# Altium project pay-optical-tls2591.PrjPCB
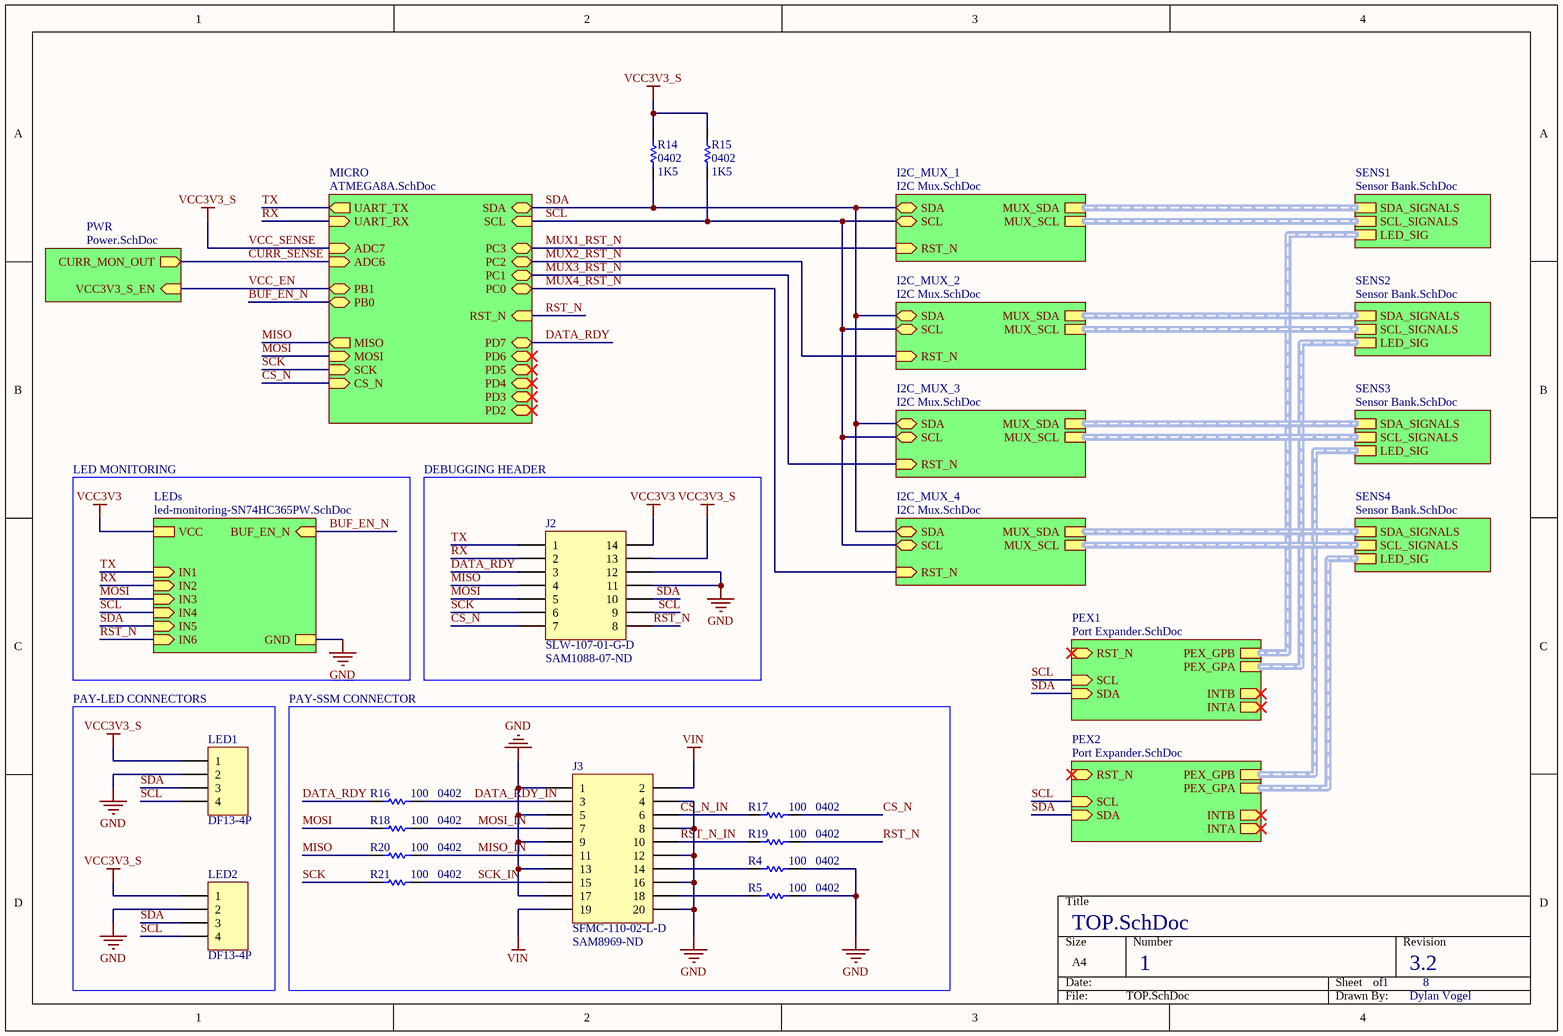
[diagram p0: TOP.SchDoc]
PROJ_AUTHOR: Dylan Vogel; PROJ_ORG: UTAT SS; PROJ_VERSION: 3.2
4 sheets, 251 parts. Net scope: hierarchical (ports join the sheet entries above them; power ports are global).
Board file: pay-optical-tls2591.PcbDoc
Sheets:
  TOP.SchDoc
    MICRO = ATMEGA8A.SchDoc
    SENS1 = Sensor Bank.SchDoc
      TSL2591_1 = TSL2591.SchDoc
      TSL2591_2 = TSL2591.SchDoc
      TSL2591_3 = TSL2591.SchDoc
      TSL2591_4 = TSL2591.SchDoc
      TSL2591_5 = TSL2591.SchDoc
      TSL2591_6 = TSL2591.SchDoc
      TSL2591_7 = TSL2591.SchDoc
      TSL2591_8 = TSL2591.SchDoc
    SENS2 = Sensor Bank.SchDoc
      TSL2591_1 = TSL2591.SchDoc
      TSL2591_2 = TSL2591.SchDoc
      TSL2591_3 = TSL2591.SchDoc
      TSL2591_4 = TSL2591.SchDoc
      TSL2591_5 = TSL2591.SchDoc
      TSL2591_6 = TSL2591.SchDoc
      TSL2591_7 = TSL2591.SchDoc
      TSL2591_8 = TSL2591.SchDoc
    SENS3 = Sensor Bank.SchDoc
      TSL2591_1 = TSL2591.SchDoc
      TSL2591_2 = TSL2591.SchDoc
      TSL2591_3 = TSL2591.SchDoc
      TSL2591_4 = TSL2591.SchDoc
      TSL2591_5 = TSL2591.SchDoc
      TSL2591_6 = TSL2591.SchDoc
      TSL2591_7 = TSL2591.SchDoc
      TSL2591_8 = TSL2591.SchDoc
    SENS4 = Sensor Bank.SchDoc
      TSL2591_1 = TSL2591.SchDoc
      TSL2591_2 = TSL2591.SchDoc
      TSL2591_3 = TSL2591.SchDoc
      TSL2591_4 = TSL2591.SchDoc
      TSL2591_5 = TSL2591.SchDoc
      TSL2591_6 = TSL2591.SchDoc
      TSL2591_7 = TSL2591.SchDoc
      TSL2591_8 = TSL2591.SchDoc

## Sheet TOP.SchDoc
size A4; DrawnBy: Dylan Vogel; Organization: UTAT SS; DocumentNumber: 1; Revision: 1.0; SheetNumber: 1; SheetTotal: 8

### Parts
J2  SLW-107-01-G-D  Supplier Part Number 1: SAM1088-07-ND  [SLW-107-01-X-D]
J3  SFMC-110-02-L-D  Supplier Part Number 1: SAM8969-ND  [SFMC-110-02-L-D]
LED1  DF13-4P  [DF13A-4P-1.25H(51)]
LED2  DF13-4P  [DF13A-4P-1.25H(51)]
R4  0402  value 100  [RES0402R]
R5  0402  value 100  [RES0402R]
R14  0402  value 1K5  [RES0402R]
R15  0402  value 1K5  [RES0402R]
R16  0402  value 100  [RES0402R]
R17  0402  value 100  [RES0402R]
R18  0402  value 100  [RES0402R]
R19  0402  value 100  [RES0402R]
R20  0402  value 100  [RES0402R]
R21  0402  value 100  [RES0402R]

### Blocks framed on the sheet
DEBUGGING HEADER: J2
PAY-LED CONNECTORS: LED1 LED2
PAY-SSM CONNECTOR: J3 R4 R5 R16-R21

### Sub-sheets
I2C_MUX_1 = I2C Mux.SchDoc (file not in this document): SDA (bidir), SCL (bidir), MUX_SCL (harness MUX_SCL), RST_N (in), MUX_SDA (harness MUX_SDA)  | ADDRESS: 0b000
I2C_MUX_2 = I2C Mux.SchDoc (file not in this document): SDA (bidir), SCL (bidir), MUX_SCL (harness MUX_SCL), RST_N (in), MUX_SDA (harness MUX_SDA)  | ADDRESS: 0b001
I2C_MUX_3 = I2C Mux.SchDoc (file not in this document): SDA (bidir), SCL (bidir), MUX_SCL (harness MUX_SCL), RST_N (in), MUX_SDA (harness MUX_SDA)  | ADDRESS: 0b010
I2C_MUX_4 = I2C Mux.SchDoc (file not in this document): SDA (bidir), SCL (bidir), MUX_SCL (harness MUX_SCL), RST_N (in), MUX_SDA (harness MUX_SDA)  | ADDRESS: 0b011
LEDs = led-monitoring-SN74HC365PW.SchDoc (file not in this document): IN3 (in), IN6 (in), IN4 (in), IN5 (in), GND, VCC, IN1 (in), IN2 (in), BUF_EN_N (in)  | LED1: ORANGE; LED2: ORANGE; LED3: GREEN; LED4: BLUE; LED5: BLUE; LED6: GREEN
MICRO = ATMEGA8A.SchDoc: PC3 (bidir), PB1 (bidir), ADC7 (in), PB0 (bidir), PC0 (bidir), ADC6 (in), PC1 (bidir), MOSI (in), PD2 (bidir), PC2 (bidir), SDA (bidir), PD7 (bidir), PD4 (bidir), MISO (out), PD6 (bidir), UART_RX (in), SCL (in), CS_N (in), RST_N (in), PD5 (bidir), SCK (in), PD3 (bidir), UART_TX (out)
PEX1 = Port Expander.SchDoc (file not in this document): SDA (in), INTA (out), INTB (out), RST_N (in), SCL (in), PEX_GPB (harness PEX_GPB), PEX_GPA (harness PEX_GPA)  | ADDRESS: 0b001
PEX2 = Port Expander.SchDoc (file not in this document): SDA (in), INTA (out), INTB (out), RST_N (in), SCL (in), PEX_GPB (harness PEX_GPB), PEX_GPA (harness PEX_GPA)  | ADDRESS: 0b010
PWR = Power.SchDoc (file not in this document): VCC3V3_S_EN (in), CURR_MON_OUT (out)
SENS1 = Sensor Bank.SchDoc: LED_SIG (harness Harness), SCL_SIGNALS (harness MUX_SCL), SDA_SIGNALS (harness MUX_SDA)
SENS2 = Sensor Bank.SchDoc: LED_SIG (harness Harness), SCL_SIGNALS (harness MUX_SCL), SDA_SIGNALS (harness MUX_SDA)
SENS3 = Sensor Bank.SchDoc: LED_SIG (harness Harness), SCL_SIGNALS (harness MUX_SCL), SDA_SIGNALS (harness MUX_SDA)
SENS4 = Sensor Bank.SchDoc: SCL_SIGNALS (harness MUX_SCL), SDA_SIGNALS (harness MUX_SDA), LED_SIG (harness LED_SIG)

### Nets
GND: J2.6(12) J2.8(11) J3.1 J3.4 J3.5 J3.8 J3.9 J3.12 J3.13 J3.16 J3.17 J3.20 LED1.2 LED2.2 R4.2 R5.2 ; sheet LEDs/GND
VCC3V3: J2.2(14) ; sheet LEDs/VCC
VCC3V3_S: J2.4(13) LED1.1 LED2.1 R14.2 R15.2 ; sheet MICRO/ADC7  [also labelled VCC_SENSE]
VIN: J3.2 J3.19
BUF_EN_N: sheet MICRO/PB0, sheet LEDs/BUF_EN_N
CS_N: J2.13(7) R17.2 ; sheet MICRO/CS_N
CS_N_IN: J3.6 R17.1
CURR_SENSE: sheet MICRO/ADC6, sheet PWR/CURR_MON_OUT
DATA_RDY: J2.5(3) R16.1 ; sheet MICRO/PD7
DATA_RDY_IN: J3.3 R16.2
MISO: J2.7(4) R20.1 ; sheet MICRO/MISO
MISO_IN: J3.11 R20.2
MOSI: J2.9(5) R18.1 ; sheet MICRO/MOSI, sheet LEDs/IN3
MOSI_IN: J3.7 R18.2
MUX1_RST_N: sheet MICRO/PC3, sheet I2C_MUX_1/RST_N
MUX2_RST_N: sheet MICRO/PC2, sheet I2C_MUX_2/RST_N
MUX3_RST_N: sheet MICRO/PC1, sheet I2C_MUX_3/RST_N
MUX4_RST_N: sheet MICRO/PC0, sheet I2C_MUX_4/RST_N
RST_N: J2.14(8) R19.2 ; sheet MICRO/RST_N, sheet LEDs/IN6
RST_N_IN: J3.10 R19.1
RX: J2.3(2) ; sheet MICRO/UART_RX, sheet LEDs/IN2
SCK: J2.11(6) R21.1 ; sheet MICRO/SCK
SCK_IN: J3.15 R21.2
SCL: J2.12(9) LED1.4 LED2.4 R15.1 ; sheet MICRO/SCL, sheet LEDs/IN4, sheet PEX1/SCL, sheet PEX2/SCL, sheet I2C_MUX_1/SCL, sheet I2C_MUX_2/SCL, sheet I2C_MUX_3/SCL, sheet I2C_MUX_4/SCL
SDA: J2.10 LED1.3 LED2.3 R14.1 ; sheet MICRO/SDA, sheet LEDs/IN5, sheet PEX1/SDA, sheet PEX2/SDA, sheet I2C_MUX_1/SDA, sheet I2C_MUX_2/SDA, sheet I2C_MUX_3/SDA, sheet I2C_MUX_4/SDA
TX: J2.1 ; sheet MICRO/UART_TX, sheet LEDs/IN1
VCC_EN: sheet MICRO/PB1, sheet PWR/VCC3V3_S_EN
NetJ3_14: J3.14 R4.1
NetJ3_18: J3.18 R5.1

### Buses and harness runs
harness sheet I2C_MUX_1/MUX_SCL = sheet SENS1/SCL_SIGNALS
harness sheet I2C_MUX_1/MUX_SDA = sheet SENS1/SDA_SIGNALS
harness sheet I2C_MUX_2/MUX_SCL = sheet SENS2/SCL_SIGNALS
harness sheet I2C_MUX_2/MUX_SDA = sheet SENS2/SDA_SIGNALS
harness sheet I2C_MUX_3/MUX_SCL = sheet SENS3/SCL_SIGNALS
harness sheet I2C_MUX_3/MUX_SDA = sheet SENS3/SDA_SIGNALS
harness sheet I2C_MUX_4/MUX_SCL = sheet SENS4/SCL_SIGNALS
harness sheet I2C_MUX_4/MUX_SDA = sheet SENS4/SDA_SIGNALS
harness sheet PEX1/PEX_GPA = sheet SENS2/LED_SIG
harness sheet PEX1/PEX_GPB = sheet SENS1/LED_SIG
harness sheet PEX2/PEX_GPA = sheet SENS4/LED_SIG
harness sheet PEX2/PEX_GPB = sheet SENS3/LED_SIG

### Notes on the sheet
- LED MONITORING

### Library data of the parts
LED1 LED2 = Header 4: Header, 4-Pin; LatestRevisionDate: 17-Jul-2002; LatestRevisionNote: Re-released for DXP Platform.; Publisher: Altium Limited
R4 R5 R14-R21 = Res1: Resistor; Published: 8-Jun-2000; LatestRevisionDate: 17-Jul-2002; LatestRevisionNote: Re-released for DXP Platform.; PackageReference: AXIAL-0.3; Publisher: Altium Limited; PackageDescription: Axial Device, Thru-Hole; 2 Leads; 0.3 in Pin Spacing; Supplier 1: Digi-Key
J2 = SLW-107-01-G-D: Supplier 1: Digi-Key
J3 = SFMC-110-02-L-D: Supplier 1: Digi-Key

## Sheet ATMEGA8A.SchDoc
size A4; DocumentNumber: 2; SheetNumber: 2; SheetTotal: 8
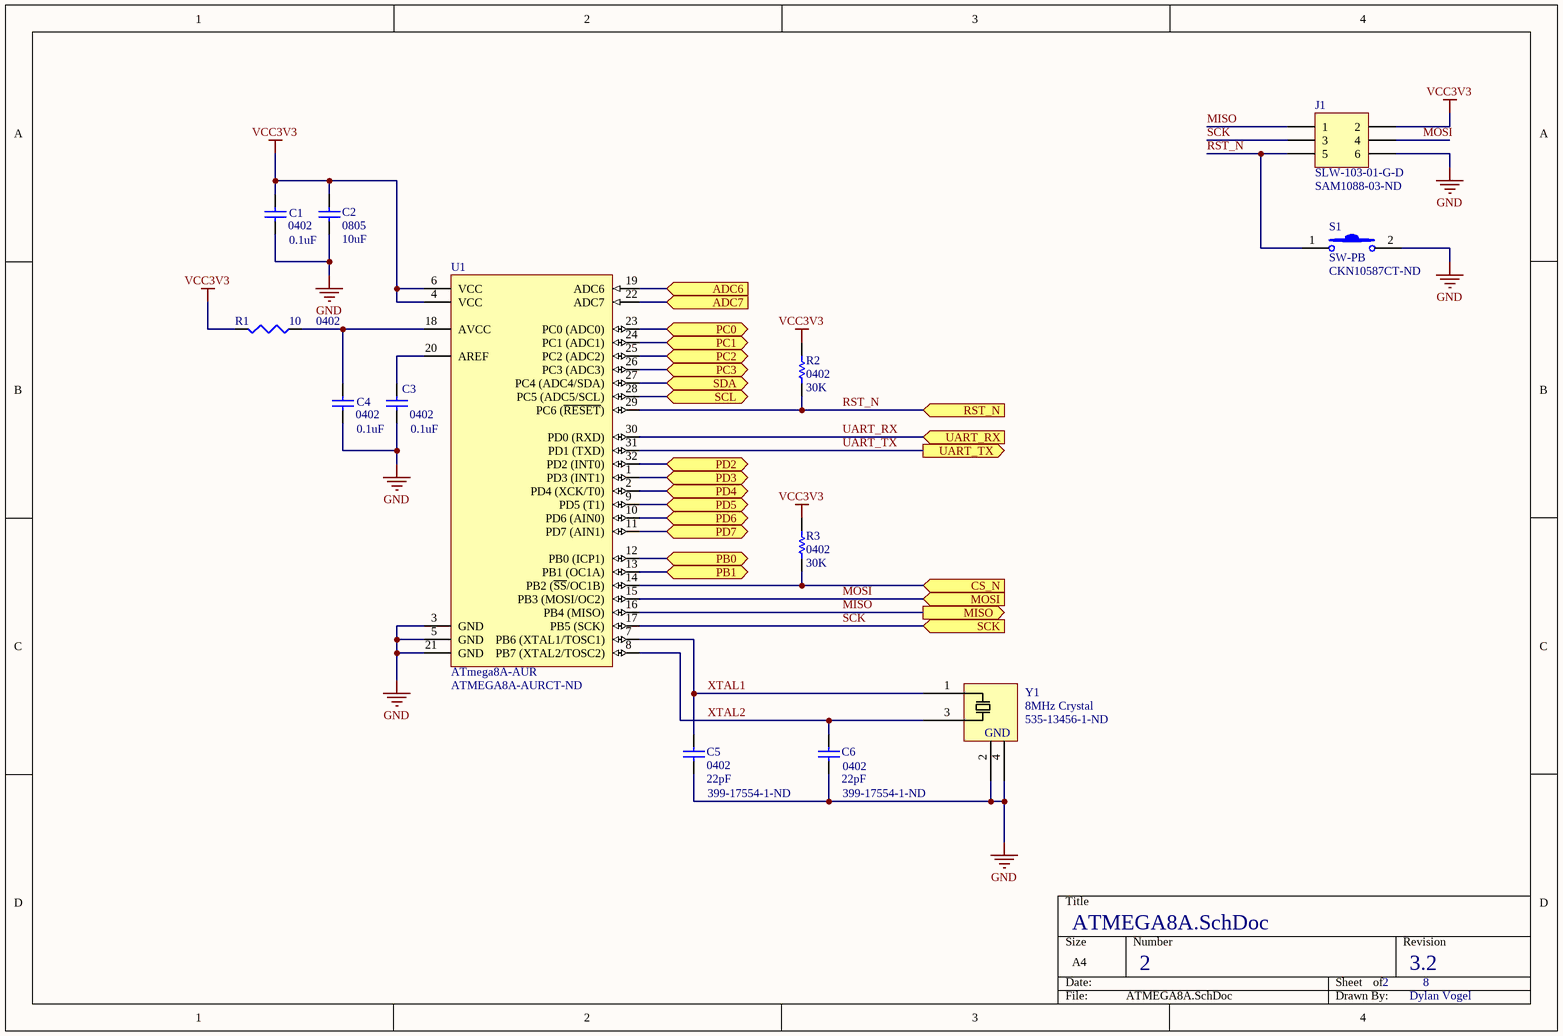
[diagram p1: ATMEGA8A.SchDoc]

### Parts
C1  0402  value 0.1uF  [CAP0402R]
C2  0805  value 10uF  [CAP0805R]
C3  0402  value 0.1uF  [CAP0402R]
C4  0402  value 0.1uF  [CAP0402R]
C5  0402  value 22pF  Supplier Part Number 1: 399-17554-1-ND  [CAP0402R]
C6  0402  value 22pF  Supplier Part Number 1: 399-17554-1-ND  [CAP0402R]
J1  SLW-103-01-G-D  Supplier Part Number 1: SAM1088-03-ND  [SLW-103-01-X-D]
R1  0402  value 10  [RES0402R]
R2  0402  value 30K  [RES0402R]
R3  0402  value 30K  [RES0402R]
S1  SW-PB  Supplier Part Number 1: CKN10587CT-ND  [PTS830GM140 SMTR LFS - Pushbutton]
U1  ATmega8A-AUR  Supplier Part Number 1: ATMEGA8A-AURCT-ND  [QFP80P900X900X120-32]
Y1  8MHz Crystal  Supplier Part Number 1: 535-13456-1-ND  [OSCSC500X320X110-4N]

### Ports
ADC6 (in), ADC7 (in), CS_N (in), MISO (out), MOSI (in), PB0 (bidir), PB1 (bidir), PC0 (bidir), PC1 (bidir), PC2 (bidir), PC3 (bidir), PD2 (bidir), PD3 (bidir), PD4 (bidir), PD5 (bidir), PD6 (bidir), PD7 (bidir), RST_N (in), SCK (in), SCL (bidir), SDA (bidir), UART_RX (in), UART_TX (out)

### Nets
GND: C1.1 C2.1 C3.1 C4.1 C5.1 C6.1 J1.6 S1.2 U1.3(GND) U1.5(GND) U1.21(GND) Y1.2 Y1.4
VCC3V3: C1.2 C2.2 J1.2 R1.2 R2.2 R3.2 U1.4(VCC) U1.6(VCC)
VCC3V3_S: U1.22(ADC7) ; port ADC7
BUF_EN_N: U1.12(PB0_(ICP1)) ; port PB0
CS_N: R3.1 U1.14(PB2_(~{SS}/OC1B)) ; port CS_N
CURR_SENSE: U1.19(ADC6) ; port ADC6
DATA_RDY: U1.11(PD7_(AIN1)) ; port PD7
MISO: J1.1 U1.16(PB4_(MISO)) ; port MISO
MOSI: J1.4 U1.15(PB3_(MOSI/OC2)) ; port MOSI
MUX1_RST_N: U1.26(PC3_(ADC3)) ; port PC3
MUX2_RST_N: U1.25(PC2_(ADC2)) ; port PC2
MUX3_RST_N: U1.24(PC1_(ADC1)) ; port PC1
MUX4_RST_N: U1.23(PC0_(ADC0)) ; port PC0
RST_N: J1.5 R2.1 S1.1 U1.29(PC6_(~{RESET})) ; port RST_N
SCK: J1.3 U1.17(PB5_(SCK)) ; port SCK
SCL: U1.28(PC5_(ADC5/SCL)) ; port SCL
SDA: U1.27(PC4_(ADC4/SDA)) ; port SDA
UART_RX: U1.30(PD0_(RXD)) ; port UART_RX  [project net RX]
UART_TX: U1.31(PD1_(TXD)) ; port UART_TX  [project net TX]
VCC_EN: U1.13(PB1_(OC1A)) ; port PB1
XTAL1: C5.2 U1.7(PB6_(XTAL1/TOSC1)) Y1.1(IN)
XTAL2: C6.2 U1.8(PB7_(XTAL2/TOSC2)) Y1.3(IN)
NetC3_2: C3.2 U1.20(AREF)
NetC4_2: C4.2 R1.1 U1.18(AVCC)
NetU1_1: U1.1(PD3_(INT1)) ; port PD3
NetU1_2: U1.2(PD4_(XCK/T0)) ; port PD4
NetU1_9: U1.9(PD5_(T1)) ; port PD5
NetU1_10: U1.10(PD6_(AIN0)) ; port PD6
NetU1_32: U1.32(PD2_(INT0)) ; port PD2

### Notes on the sheet
- (in symbol AMB3B-8MHz) GND

### Library data of the parts
C1 C3 C4 = Cap Semi: Capacitor (Semiconductor SIM Model); Manufacturer: Murata; Manufacturer Part Number: GCM155R71C104KA55J; Capacitance: 100nF; Tolerance: 10%; Voltage Rating: 16V; Dielectric: X7R; Published: 8-Jun-2000; LatestRevisionDate: 29-May-2009; LatestRevisionNote: IPC-7351 Footprint Added.; PackageReference: C1206; Publisher: Altium Limited; PackageDescription: Chip Capacitor; Supplier 1: Digi-Key; Supplier Part Number 1: 587-3807-1-ND; Supplier 2: Digi-Key; Supplier Part Number 2: 490-7998-1-ND; Stock 2: 5962647; Pricing 2: 1=0.1, 10=0.058, 100=0.026, 500=0.01858, 1000=0.0146, 2500=0.01328, 5000=0.01221 (USD); Mount: Surface Mount; Case/Package: 0402; Case Code (Imperial): 0402; Case Code (Metric): 1005; Min Operating Temperature: -55°C; Max Operating Temperature: 125°C; Voltage Rating (DC): 16V; Packaging: Tape and Reel; Package Quantity: 1; Termination: SMD/SMT; Length: 1mm; Height: 0.5mm; Width: 0.5mm; Thickness: 0.022inch; Depth: 0.5mm; Ratings: AEC-Q200; Radiation Hardening: No; Lead Free: Lead Free; ComponentLink1URL: http://psearch.murata.com/capacitor/product/GCM155R71C104KA55%23.pdf?src-supplier=Avnet; ComponentLink1Description: http://psearch.murata.com/capacitor/product/GCM155R71C104KA55%23.pdf?src-supplier=Avnet; ComponentLink2URL: http://www1.futureelectronics.com/doc/MURATA/GCM155R71C104KA55J.pdf?src-supplier=Future+Electronics; ComponentLink2Description: http://www1.futureelectronics.com/doc/MURATA/GCM155R71C104KA55J.pdf?src-supplier=Future+Electronics; ComponentLink3URL: http://psearch.en.murata.com/capacitor/product/GCM155R71C104KA55%23.pdf?src-supplier=Digi-Key; ComponentLink3Description: http://psearch.en.murata.com/capacitor/product/GCM155R71C104KA55%23.pdf?src-supplier=Digi-Key; ComponentLink4URL: http://search.murata.co.jp/Ceramy/image/img/A01X/partnumbering_e_02.pdf?src-supplier=Digi-Key; ComponentLink4Description: http://search.murata.co.jp/Ceramy/image/img/A01X/partnumbering_e_02.pdf?src-supplier=Digi-Key
  C3: Supplier 3: Digi-Key; Supplier Part Number 3: 399-17704-1-ND; Stock 3: 396535; Pricing 3: 1=0.17, 10=0.12, 100=0.0564, 500=0.03952, 1000=0.03273 (USD)
C2 = Cap: Capacitor; Manufacturer: TDK; Manufacturer Part Number: CGA4J1X7R0J106K125AC; Voltage Rating: 6.3V; Tolerance: 10%; Dielectric: X7R; Published: 8-Jun-2000; LatestRevisionDate: 17-Jul-2002; LatestRevisionNote: Re-released for DXP Platform.; PackageReference: RAD-0.3; Publisher: Altium Limited; PackageDescription: Radial Cap, Thru-Hole; 2 Leads; 0.3 in Pin Spacing; Supplier 1: Digi-Key; Supplier Part Number 1: 445-6971-1-ND; Stock 1: 793917; Pricing 1: 1=0.48, 10=0.331, 100=0.1984, 500=0.14878, 1000=0.12564 (USD); Mount: Surface Mount; Case/Package: 0805; Weight: 0.000194oz; Case Code (Metric): 2012; Case Code (Imperial): 0805; Min Operating Temperature: -55°C; Max Operating Temperature: 125°C; Package Quantity: 1; Capacitance: 10uF; Packaging: Tape and Reel; Voltage Rating (DC): 6.3V; Termination: SMD/SMT; Composition: Ceramic; Length: 2mm; Height: 1.25mm; Width: 0.049inch; Thickness: 0.057inch; Depth: 1.25mm; Ratings: AEC-Q200; REACH SVHC: No SVHC; Lead Free: Lead Free; ComponentLink1URL: http://www.farnell.com/datasheets/1807242.pdf?src-supplier=Element14; ComponentLink1Description: http://www.farnell.com/datasheets/1807242.pdf?src-supplier=Element14; ComponentLink2URL: http://product.tdk.com/capacitor/mlcc/detailed_information.php?lang=en&amp;ref=jp&amp;part_no=CGA4J1X7R0J106K125AC&src-supplier=Mouser; ComponentLink2Description: http://product.tdk.com/capacitor/mlcc/detailed_information.php?lang=en&amp;ref=jp&amp;part_no=CGA4J1X7R0J106K125AC&src-supplier=Mouser
C5 C6 = Cap: Capacitor; Manufacturer: KEMET; Manufacturer Part Number: C0402C220K4RAC7867; Tolerance: 10%; Voltage Rating: 16V; Published: 8-Jun-2000; LatestRevisionDate: 17-Jul-2002; LatestRevisionNote: Re-released for DXP Platform.; PackageReference: RAD-0.3; Publisher: Altium Limited; PackageDescription: Radial Cap, Thru-Hole; 2 Leads; 0.3 in Pin Spacing; Supplier 1: Digi-Key; Stock 1: 72125; Pricing 1: 1=0.19, 10=0.132, 100=0.062, 500=0.0435, 1000=0.03601, 2500=0.03351, 5000=0.03066 (USD); Mount: Surface Mount; Case/Package: 0402; Case Code (Imperial): 0402; Case Code (Metric): 1005; Min Operating Temperature: -55°C; Max Operating Temperature: 125°C; Packaging: Tape and Reel; Capacitance: 22pF
R1 = Res3: Resistor; Published: 8-Jun-2000; LatestRevisionDate: 29-May-2009; LatestRevisionNote: IPC-7351 Footprint Added.; PackageReference: J1-0603; Publisher: Altium Limited; PackageDescription: Chip Resistor; Supplier 1: Digi-Key
R2 R3 = Res1: Resistor; Published: 8-Jun-2000; LatestRevisionDate: 17-Jul-2002; LatestRevisionNote: Re-released for DXP Platform.; PackageReference: AXIAL-0.3; Publisher: Altium Limited; PackageDescription: Axial Device, Thru-Hole; 2 Leads; 0.3 in Pin Spacing; Supplier 1: Digi-Key
S1 = Pushbutton - Low Profile: Schematic symbol for a generic 2-pin pushbutton, OFF-mom.; Supplier 1: Digi-Key
U1 = ATMEGA8A-AUR: 8-bit AVR Microcontroller, 2.7-5.5V, 16MHz, 8KB Flash, 512 Bytes EEPROM, 1KB SRAM, 32-pin TQFP, Industrial Grade (-40°C to 85°C), Reel; ComponentLink1Description: Manufacturer URL; ComponentLink2Description: ATmega8A Datasheet; DatasheetVersion: revD, Feb-2011; ComponentLink3URL: http://www.atmel.com/dyn/resources/prod_documents/8159S.pdf; ComponentLink3Description: ATmega8A Summary; ComponentLink1URL: http://www.atmel.com/; Code_JEDEC: MS-026-ABA; PackageVersion: revC, Oct-2010; PackageDescription: 32-Lead, 7x7x1.0 mm Body, 0.8mm Lead Pitch, Thin Profile Plastic Quad Flat Package (TQFP); ComponentLink2URL: http://www.atmel.com/dyn/resources/prod_documents/doc8159.pdf; PackageReference: 32A; PartNumber: ATMEGA8A-AUR; Supplier 1: Digi-Key
Y1 = AMB3B-8MHz: 8MHz Abracom 4-pin crystal.; Supplier 1: Digi-Key
J1 = SLW-103-01-G-D: Supplier 1: Digi-Key

## Sheet Sensor Bank.SchDoc
size A4; DocumentNumber: 6; SheetNumber: 6; SheetTotal: 8
Used 4 times, as channels SENS1, SENS2, SENS3, SENS4. Parts and nets are listed once, with the designators drawn on the sheet.
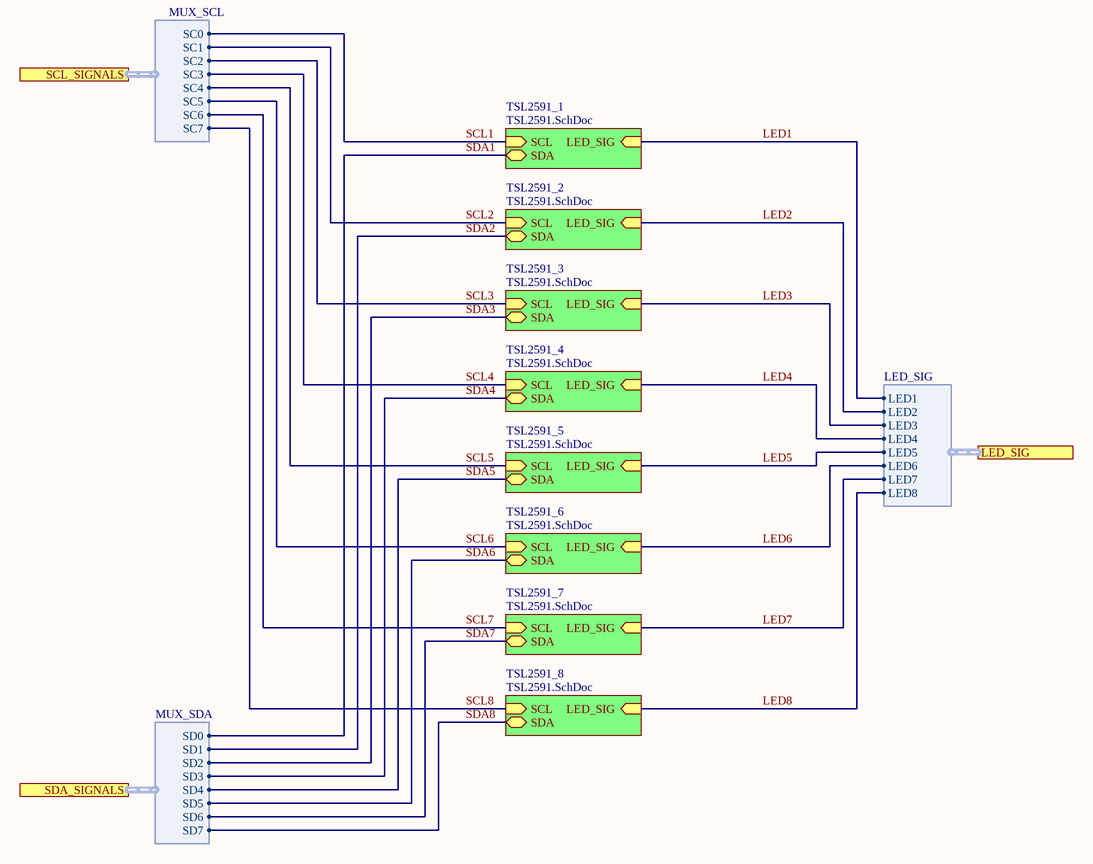
[diagram p2: Sensor Bank.SchDoc]

### Sub-sheets
TSL2591_1 = TSL2591.SchDoc: SCL (in), SDA (bidir), LED_SIG (in)
TSL2591_2 = TSL2591.SchDoc: SCL (in), SDA (bidir), LED_SIG (in)
TSL2591_3 = TSL2591.SchDoc: SCL (in), SDA (bidir), LED_SIG (in)
TSL2591_4 = TSL2591.SchDoc: SCL (in), SDA (bidir), LED_SIG (in)
TSL2591_5 = TSL2591.SchDoc: SCL (in), SDA (bidir), LED_SIG (in)
TSL2591_6 = TSL2591.SchDoc: SCL (in), SDA (bidir), LED_SIG (in)
TSL2591_7 = TSL2591.SchDoc: SCL (in), SDA (bidir), LED_SIG (in)
TSL2591_8 = TSL2591.SchDoc: SCL (in), SDA (bidir), LED_SIG (in)

### Ports
LED_SIG (harness LED_SIG), SCL_SIGNALS (harness MUX_SCL), SDA_SIGNALS (harness MUX_SDA)

### Harnesses
LED_SIG: LED1, LED2, LED3, LED4, LED5, LED6, LED7, LED8
MUX_SDA: SD0, SD1, SD2, SD3, SD4, SD5, SD6, SD7
MUX_SCL: SC0, SC1, SC2, SC3, SC4, SC5, SC6, SC7

### Nets
LED1: sheet TSL2591_1/LED_SIG, port LED_SIG.LED1
LED2: sheet TSL2591_2/LED_SIG, port LED_SIG.LED2
LED3: sheet TSL2591_3/LED_SIG, port LED_SIG.LED3
LED4: sheet TSL2591_4/LED_SIG, port LED_SIG.LED4
LED5: sheet TSL2591_5/LED_SIG, port LED_SIG.LED5
LED6: sheet TSL2591_6/LED_SIG, port LED_SIG.LED6
LED7: sheet TSL2591_7/LED_SIG, port LED_SIG.LED7
LED8: sheet TSL2591_8/LED_SIG, port LED_SIG.LED8
SCL1: sheet TSL2591_1/SCL, port SCL_SIGNALS.SC0
SCL2: sheet TSL2591_2/SCL, port SCL_SIGNALS.SC1
SCL3: sheet TSL2591_3/SCL, port SCL_SIGNALS.SC2
SCL4: sheet TSL2591_4/SCL, port SCL_SIGNALS.SC3
SCL5: sheet TSL2591_5/SCL, port SCL_SIGNALS.SC4
SCL6: sheet TSL2591_6/SCL, port SCL_SIGNALS.SC5
SCL7: sheet TSL2591_7/SCL, port SCL_SIGNALS.SC6
SCL8: sheet TSL2591_8/SCL, port SCL_SIGNALS.SC7
SDA1: sheet TSL2591_1/SDA, port SDA_SIGNALS.SD0
SDA2: sheet TSL2591_2/SDA, port SDA_SIGNALS.SD1
SDA3: sheet TSL2591_3/SDA, port SDA_SIGNALS.SD2
SDA4: sheet TSL2591_4/SDA, port SDA_SIGNALS.SD3
SDA5: sheet TSL2591_5/SDA, port SDA_SIGNALS.SD4
SDA6: sheet TSL2591_6/SDA, port SDA_SIGNALS.SD5
SDA7: sheet TSL2591_7/SDA, port SDA_SIGNALS.SD6
SDA8: sheet TSL2591_8/SDA, port SDA_SIGNALS.SD7

### Channels
SENS1: no parts or ports
SENS2: no parts or ports
SENS3: no parts or ports
SENS4: no parts or ports

## Sheet TSL2591.SchDoc
size A4; DocumentNumber: 7; SheetNumber: 7; SheetTotal: 8
Used 32 times, as channels SENS1/TSL2591_1, SENS1/TSL2591_2, SENS1/TSL2591_3, SENS1/TSL2591_4, SENS1/TSL2591_5, SENS1/TSL2591_6, SENS1/TSL2591_7, SENS1/TSL2591_8, SENS2/TSL2591_1, SENS2/TSL2591_2, SENS2/TSL2591_3, SENS2/TSL2591_4, SENS2/TSL2591_5, SENS2/TSL2591_6, SENS2/TSL2591_7, SENS2/TSL2591_8, SENS3/TSL2591_1, SENS3/TSL2591_2, SENS3/TSL2591_3, SENS3/TSL2591_4, SENS3/TSL2591_5, SENS3/TSL2591_6, SENS3/TSL2591_7, SENS3/TSL2591_8, SENS4/TSL2591_1, SENS4/TSL2591_2, SENS4/TSL2591_3, SENS4/TSL2591_4, SENS4/TSL2591_5, SENS4/TSL2591_6, SENS4/TSL2591_7, SENS4/TSL2591_8. Parts and nets are listed once, with the designators drawn on the sheet.
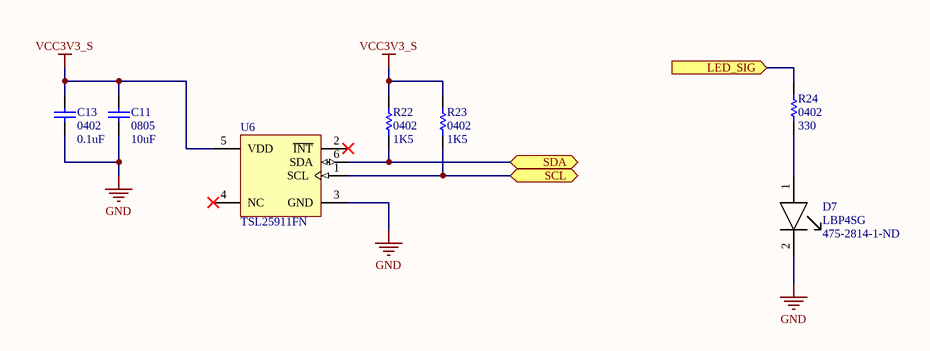
[diagram p3: TSL2591.SchDoc]

### Parts
C11  0805  value 10uF  [CAP0805R]
C13  0402  value 0.1uF  [CAP0402R]
D7  LBP4SG  Supplier Part Number 1: 475-2814-1-ND  [LB P4SG]
R22  0402  value 1K5  [RES0402R]
R23  0402  value 1K5  [RES0402R]
R24  0402  value 330  [RES0402R]
U6  TSL25911FN  [AMS-FN-6-2400X2000DE_V]

### Ports
LED_SIG (in), SCL (bidir), SDA (bidir)

### Nets
GND: C11.1 C13.1 D7.2(Cathode) U6.3(GND)
VCC3V3_S: C11.2 C13.2 R22.2 R23.2 U6.5(VDD)
LED_SIG: R24.1 ; port LED_SIG
SCL: R23.1 U6.1(SCL) ; port SCL
SDA: R22.1 U6.6(SDA) ; port SDA
NetD7_1: D7.1(Anode) R24.2

Not connected (* = marked no-connect by the designer): U6 2(~{INT})* 4(NC)*

### Channels
SENS1/TSL2591_1: designators end in _SENS1_TSL2591_1; ports LED_SIG=LED1_SENS1 SCL=SCL1_SENS1 SDA=SDA1_SENS1
SENS1/TSL2591_2: designators end in _SENS1_TSL2591_2; ports LED_SIG=LED2_SENS1 SCL=SCL2_SENS1 SDA=SDA2_SENS1
SENS1/TSL2591_3: designators end in _SENS1_TSL2591_3; ports LED_SIG=LED3_SENS1 SCL=SCL3_SENS1 SDA=SDA3_SENS1
SENS1/TSL2591_4: designators end in _SENS1_TSL2591_4; ports LED_SIG=LED4_SENS1 SCL=SCL4_SENS1 SDA=SDA4_SENS1
SENS1/TSL2591_5: designators end in _SENS1_TSL2591_5; ports LED_SIG=LED5_SENS1 SCL=SCL5_SENS1 SDA=SDA5_SENS1
SENS1/TSL2591_6: designators end in _SENS1_TSL2591_6; ports LED_SIG=LED6_SENS1 SCL=SCL6_SENS1 SDA=SDA6_SENS1
SENS1/TSL2591_7: designators end in _SENS1_TSL2591_7; ports LED_SIG=LED7_SENS1 SCL=SCL7_SENS1 SDA=SDA7_SENS1
SENS1/TSL2591_8: designators end in _SENS1_TSL2591_8; ports LED_SIG=LED8_SENS1 SCL=SCL8_SENS1 SDA=SDA8_SENS1
SENS2/TSL2591_1: designators end in _SENS2_TSL2591_1; ports LED_SIG=LED1_SENS2 SCL=SCL1_SENS2 SDA=SDA1_SENS2
SENS2/TSL2591_2: designators end in _SENS2_TSL2591_2; ports LED_SIG=LED2_SENS2 SCL=SCL2_SENS2 SDA=SDA2_SENS2
SENS2/TSL2591_3: designators end in _SENS2_TSL2591_3; ports LED_SIG=LED3_SENS2 SCL=SCL3_SENS2 SDA=SDA3_SENS2
SENS2/TSL2591_4: designators end in _SENS2_TSL2591_4; ports LED_SIG=LED4_SENS2 SCL=SCL4_SENS2 SDA=SDA4_SENS2
SENS2/TSL2591_5: designators end in _SENS2_TSL2591_5; ports LED_SIG=LED5_SENS2 SCL=SCL5_SENS2 SDA=SDA5_SENS2
SENS2/TSL2591_6: designators end in _SENS2_TSL2591_6; ports LED_SIG=LED6_SENS2 SCL=SCL6_SENS2 SDA=SDA6_SENS2
SENS2/TSL2591_7: designators end in _SENS2_TSL2591_7; ports LED_SIG=LED7_SENS2 SCL=SCL7_SENS2 SDA=SDA7_SENS2
SENS2/TSL2591_8: designators end in _SENS2_TSL2591_8; ports LED_SIG=LED8_SENS2 SCL=SCL8_SENS2 SDA=SDA8_SENS2
SENS3/TSL2591_1: designators end in _SENS3_TSL2591_1; ports LED_SIG=LED1_SENS3 SCL=SCL1_SENS3 SDA=SDA1_SENS3
SENS3/TSL2591_2: designators end in _SENS3_TSL2591_2; ports LED_SIG=LED2_SENS3 SCL=SCL2_SENS3 SDA=SDA2_SENS3
SENS3/TSL2591_3: designators end in _SENS3_TSL2591_3; ports LED_SIG=LED3_SENS3 SCL=SCL3_SENS3 SDA=SDA3_SENS3
SENS3/TSL2591_4: designators end in _SENS3_TSL2591_4; ports LED_SIG=LED4_SENS3 SCL=SCL4_SENS3 SDA=SDA4_SENS3
SENS3/TSL2591_5: designators end in _SENS3_TSL2591_5; ports LED_SIG=LED5_SENS3 SCL=SCL5_SENS3 SDA=SDA5_SENS3
SENS3/TSL2591_6: designators end in _SENS3_TSL2591_6; ports LED_SIG=LED6_SENS3 SCL=SCL6_SENS3 SDA=SDA6_SENS3
SENS3/TSL2591_7: designators end in _SENS3_TSL2591_7; ports LED_SIG=LED7_SENS3 SCL=SCL7_SENS3 SDA=SDA7_SENS3
SENS3/TSL2591_8: designators end in _SENS3_TSL2591_8; ports LED_SIG=LED8_SENS3 SCL=SCL8_SENS3 SDA=SDA8_SENS3
SENS4/TSL2591_1: designators end in _SENS4_TSL2591_1; ports LED_SIG=LED1_SENS4 SCL=SCL1_SENS4 SDA=SDA1_SENS4
SENS4/TSL2591_2: designators end in _SENS4_TSL2591_2; ports LED_SIG=LED2_SENS4 SCL=SCL2_SENS4 SDA=SDA2_SENS4
SENS4/TSL2591_3: designators end in _SENS4_TSL2591_3; ports LED_SIG=LED3_SENS4 SCL=SCL3_SENS4 SDA=SDA3_SENS4
SENS4/TSL2591_4: designators end in _SENS4_TSL2591_4; ports LED_SIG=LED4_SENS4 SCL=SCL4_SENS4 SDA=SDA4_SENS4
SENS4/TSL2591_5: designators end in _SENS4_TSL2591_5; ports LED_SIG=LED5_SENS4 SCL=SCL5_SENS4 SDA=SDA5_SENS4
SENS4/TSL2591_6: designators end in _SENS4_TSL2591_6; ports LED_SIG=LED6_SENS4 SCL=SCL6_SENS4 SDA=SDA6_SENS4
SENS4/TSL2591_7: designators end in _SENS4_TSL2591_7; ports LED_SIG=LED7_SENS4 SCL=SCL7_SENS4 SDA=SDA7_SENS4
SENS4/TSL2591_8: designators end in _SENS4_TSL2591_8; ports LED_SIG=LED8_SENS4 SCL=SCL8_SENS4 SDA=SDA8_SENS4

### Library data of the parts
C11 = Cap: as C2 on sheet ATMEGA8A; Published: 8-Jun-2000; LatestRevisionDate: 17-Jul-2002; LatestRevisionNote: Re-released for DXP Platform.; PackageReference: RAD-0.3; Publisher: Altium Limited; PackageDescription: Radial Cap, Thru-Hole; 2 Leads; 0.3 in Pin Spacing; Supplier 1: Digi-Key; Supplier Part Number 1: 445-6971-1-ND; Stock 1: 793917; Pricing 1: 1=0.48, 10=0.331, 100=0.1984, 500=0.14878, 1000=0.12564 (USD); Mount: Surface Mount; Case/Package: 0805; Weight: 0.000194oz; Case Code (Metric): 2012; Case Code (Imperial): 0805; Min Operating Temperature: -55°C; Max Operating Temperature: 125°C; Package Quantity: 1; Capacitance: 10uF; Packaging: Tape and Reel; Voltage Rating (DC): 6.3V; Termination: SMD/SMT; Composition: Ceramic; Length: 2mm; Height: 1.25mm; Width: 0.049inch; Thickness: 0.057inch; Depth: 1.25mm; Ratings: AEC-Q200; REACH SVHC: No SVHC; Lead Free: Lead Free; ComponentLink1URL: http://www.farnell.com/datasheets/1807242.pdf?src-supplier=Element14; ComponentLink1Description: http://www.farnell.com/datasheets/1807242.pdf?src-supplier=Element14; ComponentLink2URL: http://product.tdk.com/capacitor/mlcc/detailed_information.php?lang=en&amp;ref=jp&amp;part_no=CGA4J1X7R0J106K125AC&src-supplier=Mouser; ComponentLink2Description: http://product.tdk.com/capacitor/mlcc/detailed_information.php?lang=en&amp;ref=jp&amp;part_no=CGA4J1X7R0J106K125AC&src-supplier=Mouser
C13 = Cap: Capacitor; Manufacturer: Murata; Manufacturer Part Number: GCM155R71C104KA55J; Capacitance: 100nF; Tolerance: 10%; Voltage Rating: 16V; Dielectric: X7R; Published: 8-Jun-2000; LatestRevisionDate: 17-Jul-2002; LatestRevisionNote: Re-released for DXP Platform.; PackageReference: RAD-0.3; Publisher: Altium Limited; PackageDescription: Radial Cap, Thru-Hole; 2 Leads; 0.3 in Pin Spacing; Supplier 1: Digi-Key; Supplier 2: Digi-Key; Supplier Part Number 2: 490-7998-1-ND; Stock 2: 5962647; Pricing 2: 1=0.1, 10=0.058, 100=0.026, 500=0.01858, 1000=0.0146, 2500=0.01328, 5000=0.01221 (USD); Mount: Surface Mount; Case/Package: 0402; Case Code (Imperial): 0402; Case Code (Metric): 1005; Min Operating Temperature: -55°C; Max Operating Temperature: 125°C; Voltage Rating (DC): 16V; Packaging: Tape and Reel; Package Quantity: 1; Termination: SMD/SMT; Length: 1mm; Height: 0.5mm; Width: 0.5mm; Thickness: 0.022inch; Depth: 0.5mm; Ratings: AEC-Q200; Radiation Hardening: No; Lead Free: Lead Free; ComponentLink1URL: http://psearch.murata.com/capacitor/product/GCM155R71C104KA55%23.pdf?src-supplier=Avnet; ComponentLink1Description: http://psearch.murata.com/capacitor/product/GCM155R71C104KA55%23.pdf?src-supplier=Avnet; ComponentLink2URL: http://www1.futureelectronics.com/doc/MURATA/GCM155R71C104KA55J.pdf?src-supplier=Future+Electronics; ComponentLink2Description: http://www1.futureelectronics.com/doc/MURATA/GCM155R71C104KA55J.pdf?src-supplier=Future+Electronics; ComponentLink3URL: http://psearch.en.murata.com/capacitor/product/GCM155R71C104KA55%23.pdf?src-supplier=Digi-Key; ComponentLink3Description: http://psearch.en.murata.com/capacitor/product/GCM155R71C104KA55%23.pdf?src-supplier=Digi-Key; ComponentLink4URL: http://search.murata.co.jp/Ceramy/image/img/A01X/partnumbering_e_02.pdf?src-supplier=Digi-Key; ComponentLink4Description: http://search.murata.co.jp/Ceramy/image/img/A01X/partnumbering_e_02.pdf?src-supplier=Digi-Key
D7 = LB P4SG: LED BLUE CLEAR SMD BOTTOM ENTRY; Supplier 1: Digi-Key
R22-R24 = Res1: Resistor; Published: 8-Jun-2000; LatestRevisionDate: 17-Jul-2002; LatestRevisionNote: Re-released for DXP Platform.; PackageReference: AXIAL-0.3; Publisher: Altium Limited; PackageDescription: Axial Device, Thru-Hole; 2 Leads; 0.3 in Pin Spacing; Supplier 1: Digi-Key
U6 = TSL25911FN: Light-to-Digital Converter with I2C Interface, 2.7 to 3.6 V, -30 to 70 degC, FN-6, Pb-Free, Reel; Manufacturer: AMS; Supply Voltage (V): 2.7 - 3.6; Maximum Lux: 88K; Interface: I2C - Vdd; Programmable: Gain, Integration Time, Interrupt; ComponentLink1Description: Manufacturer URL; ComponentLink2Description: Datasheet; Mounting Technology: Surface Mount; ComponentLink1URL: www.ams.com; PackageVersion: TAOS059Q, 11/2009; PartNumber: TSL25911FN; PackageReference: FN-6; PackageDescription: 6-Pin Dual Flat No-Lead, 2.4 x 2 mm Body, 0.65 mm Pitch; ComponentLink2URL: http://www.ams.com/eng/content/download/389383/1251117/221235

## Nets that join several sheets
GND: TOP (16 pins), ATMEGA8A (13 pins), SENS1/TSL2591_1 (C11_SENS1_TSL2591_1.1 C13_SENS1_TSL2591_1.1 D7_SENS1_TSL2591_1.2 U6_SENS1_TSL2591_1.3), SENS1/TSL2591_2 (C11_SENS1_TSL2591_2.1 C13_SENS1_TSL2591_2.1 D7_SENS1_TSL2591_2.2 U6_SENS1_TSL2591_2.3), SENS1/TSL2591_3 (C11_SENS1_TSL2591_3.1 C13_SENS1_TSL2591_3.1 D7_SENS1_TSL2591_3.2 U6_SENS1_TSL2591_3.3), SENS1/TSL2591_4 (C11_SENS1_TSL2591_4.1 C13_SENS1_TSL2591_4.1 D7_SENS1_TSL2591_4.2 U6_SENS1_TSL2591_4.3), SENS1/TSL2591_5 (C11_SENS1_TSL2591_5.1 C13_SENS1_TSL2591_5.1 D7_SENS1_TSL2591_5.2 U6_SENS1_TSL2591_5.3), SENS1/TSL2591_6 (C11_SENS1_TSL2591_6.1 C13_SENS1_TSL2591_6.1 D7_SENS1_TSL2591_6.2 U6_SENS1_TSL2591_6.3), SENS1/TSL2591_7 (C11_SENS1_TSL2591_7.1 C13_SENS1_TSL2591_7.1 D7_SENS1_TSL2591_7.2 U6_SENS1_TSL2591_7.3), SENS1/TSL2591_8 (C11_SENS1_TSL2591_8.1 C13_SENS1_TSL2591_8.1 D7_SENS1_TSL2591_8.2 U6_SENS1_TSL2591_8.3), SENS2/TSL2591_1 (C11_SENS2_TSL2591_1.1 C13_SENS2_TSL2591_1.1 D7_SENS2_TSL2591_1.2 U6_SENS2_TSL2591_1.3), SENS2/TSL2591_2 (C11_SENS2_TSL2591_2.1 C13_SENS2_TSL2591_2.1 D7_SENS2_TSL2591_2.2 U6_SENS2_TSL2591_2.3), SENS2/TSL2591_3 (C11_SENS2_TSL2591_3.1 C13_SENS2_TSL2591_3.1 D7_SENS2_TSL2591_3.2 U6_SENS2_TSL2591_3.3), SENS2/TSL2591_4 (C11_SENS2_TSL2591_4.1 C13_SENS2_TSL2591_4.1 D7_SENS2_TSL2591_4.2 U6_SENS2_TSL2591_4.3), SENS2/TSL2591_5 (C11_SENS2_TSL2591_5.1 C13_SENS2_TSL2591_5.1 D7_SENS2_TSL2591_5.2 U6_SENS2_TSL2591_5.3), SENS2/TSL2591_6 (C11_SENS2_TSL2591_6.1 C13_SENS2_TSL2591_6.1 D7_SENS2_TSL2591_6.2 U6_SENS2_TSL2591_6.3), SENS2/TSL2591_7 (C11_SENS2_TSL2591_7.1 C13_SENS2_TSL2591_7.1 D7_SENS2_TSL2591_7.2 U6_SENS2_TSL2591_7.3), SENS2/TSL2591_8 (C11_SENS2_TSL2591_8.1 C13_SENS2_TSL2591_8.1 D7_SENS2_TSL2591_8.2 U6_SENS2_TSL2591_8.3), SENS3/TSL2591_1 (C11_SENS3_TSL2591_1.1 C13_SENS3_TSL2591_1.1 D7_SENS3_TSL2591_1.2 U6_SENS3_TSL2591_1.3), SENS3/TSL2591_2 (C11_SENS3_TSL2591_2.1 C13_SENS3_TSL2591_2.1 D7_SENS3_TSL2591_2.2 U6_SENS3_TSL2591_2.3), SENS3/TSL2591_3 (C11_SENS3_TSL2591_3.1 C13_SENS3_TSL2591_3.1 D7_SENS3_TSL2591_3.2 U6_SENS3_TSL2591_3.3), SENS3/TSL2591_4 (C11_SENS3_TSL2591_4.1 C13_SENS3_TSL2591_4.1 D7_SENS3_TSL2591_4.2 U6_SENS3_TSL2591_4.3), SENS3/TSL2591_5 (C11_SENS3_TSL2591_5.1 C13_SENS3_TSL2591_5.1 D7_SENS3_TSL2591_5.2 U6_SENS3_TSL2591_5.3), SENS3/TSL2591_6 (C11_SENS3_TSL2591_6.1 C13_SENS3_TSL2591_6.1 D7_SENS3_TSL2591_6.2 U6_SENS3_TSL2591_6.3), SENS3/TSL2591_7 (C11_SENS3_TSL2591_7.1 C13_SENS3_TSL2591_7.1 D7_SENS3_TSL2591_7.2 U6_SENS3_TSL2591_7.3), SENS3/TSL2591_8 (C11_SENS3_TSL2591_8.1 C13_SENS3_TSL2591_8.1 D7_SENS3_TSL2591_8.2 U6_SENS3_TSL2591_8.3), SENS4/TSL2591_1 (C11_SENS4_TSL2591_1.1 C13_SENS4_TSL2591_1.1 D7_SENS4_TSL2591_1.2 U6_SENS4_TSL2591_1.3), SENS4/TSL2591_2 (C11_SENS4_TSL2591_2.1 C13_SENS4_TSL2591_2.1 D7_SENS4_TSL2591_2.2 U6_SENS4_TSL2591_2.3), SENS4/TSL2591_3 (C11_SENS4_TSL2591_3.1 C13_SENS4_TSL2591_3.1 D7_SENS4_TSL2591_3.2 U6_SENS4_TSL2591_3.3), SENS4/TSL2591_4 (C11_SENS4_TSL2591_4.1 C13_SENS4_TSL2591_4.1 D7_SENS4_TSL2591_4.2 U6_SENS4_TSL2591_4.3), SENS4/TSL2591_5 (C11_SENS4_TSL2591_5.1 C13_SENS4_TSL2591_5.1 D7_SENS4_TSL2591_5.2 U6_SENS4_TSL2591_5.3), SENS4/TSL2591_6 (C11_SENS4_TSL2591_6.1 C13_SENS4_TSL2591_6.1 D7_SENS4_TSL2591_6.2 U6_SENS4_TSL2591_6.3), SENS4/TSL2591_7 (C11_SENS4_TSL2591_7.1 C13_SENS4_TSL2591_7.1 D7_SENS4_TSL2591_7.2 U6_SENS4_TSL2591_7.3), SENS4/TSL2591_8 (C11_SENS4_TSL2591_8.1 C13_SENS4_TSL2591_8.1 D7_SENS4_TSL2591_8.2 U6_SENS4_TSL2591_8.3)
VCC3V3: TOP (J2.2), ATMEGA8A (8 pins)
VCC3V3_S: TOP (5 pins), ATMEGA8A (U1.22), SENS1/TSL2591_1 (5 pins), SENS1/TSL2591_2 (5 pins), SENS1/TSL2591_3 (5 pins), SENS1/TSL2591_4 (5 pins), SENS1/TSL2591_5 (5 pins), SENS1/TSL2591_6 (5 pins), SENS1/TSL2591_7 (5 pins), SENS1/TSL2591_8 (5 pins), SENS2/TSL2591_1 (5 pins), SENS2/TSL2591_2 (5 pins), SENS2/TSL2591_3 (5 pins), SENS2/TSL2591_4 (5 pins), SENS2/TSL2591_5 (5 pins), SENS2/TSL2591_6 (5 pins), SENS2/TSL2591_7 (5 pins), SENS2/TSL2591_8 (5 pins), SENS3/TSL2591_1 (5 pins), SENS3/TSL2591_2 (5 pins), SENS3/TSL2591_3 (5 pins), SENS3/TSL2591_4 (5 pins), SENS3/TSL2591_5 (5 pins), SENS3/TSL2591_6 (5 pins), SENS3/TSL2591_7 (5 pins), SENS3/TSL2591_8 (5 pins), SENS4/TSL2591_1 (5 pins), SENS4/TSL2591_2 (5 pins), SENS4/TSL2591_3 (5 pins), SENS4/TSL2591_4 (5 pins), SENS4/TSL2591_5 (5 pins), SENS4/TSL2591_6 (5 pins), SENS4/TSL2591_7 (5 pins), SENS4/TSL2591_8 (5 pins)
CS_N: TOP (J2.13 R17.2), ATMEGA8A (R3.1 U1.14)
DATA_RDY: TOP (J2.5 R16.1), ATMEGA8A (U1.11)
MISO: TOP (J2.7 R20.1), ATMEGA8A (J1.1 U1.16)
MOSI: TOP (J2.9 R18.1), ATMEGA8A (J1.4 U1.15)
RST_N: TOP (J2.14 R19.2), ATMEGA8A (J1.5 R2.1 S1.1 U1.29)
RX: TOP (J2.3), ATMEGA8A (U1.30)
SCK: TOP (J2.11 R21.1), ATMEGA8A (J1.3 U1.17)
SCL: TOP (J2.12 LED1.4 LED2.4 R15.1), ATMEGA8A (U1.28)
SDA: TOP (J2.10 LED1.3 LED2.3 R14.1), ATMEGA8A (U1.27)
TX: TOP (J2.1), ATMEGA8A (U1.31)